# Altium project ESC30A.PrjPcb (part 1 of 2)
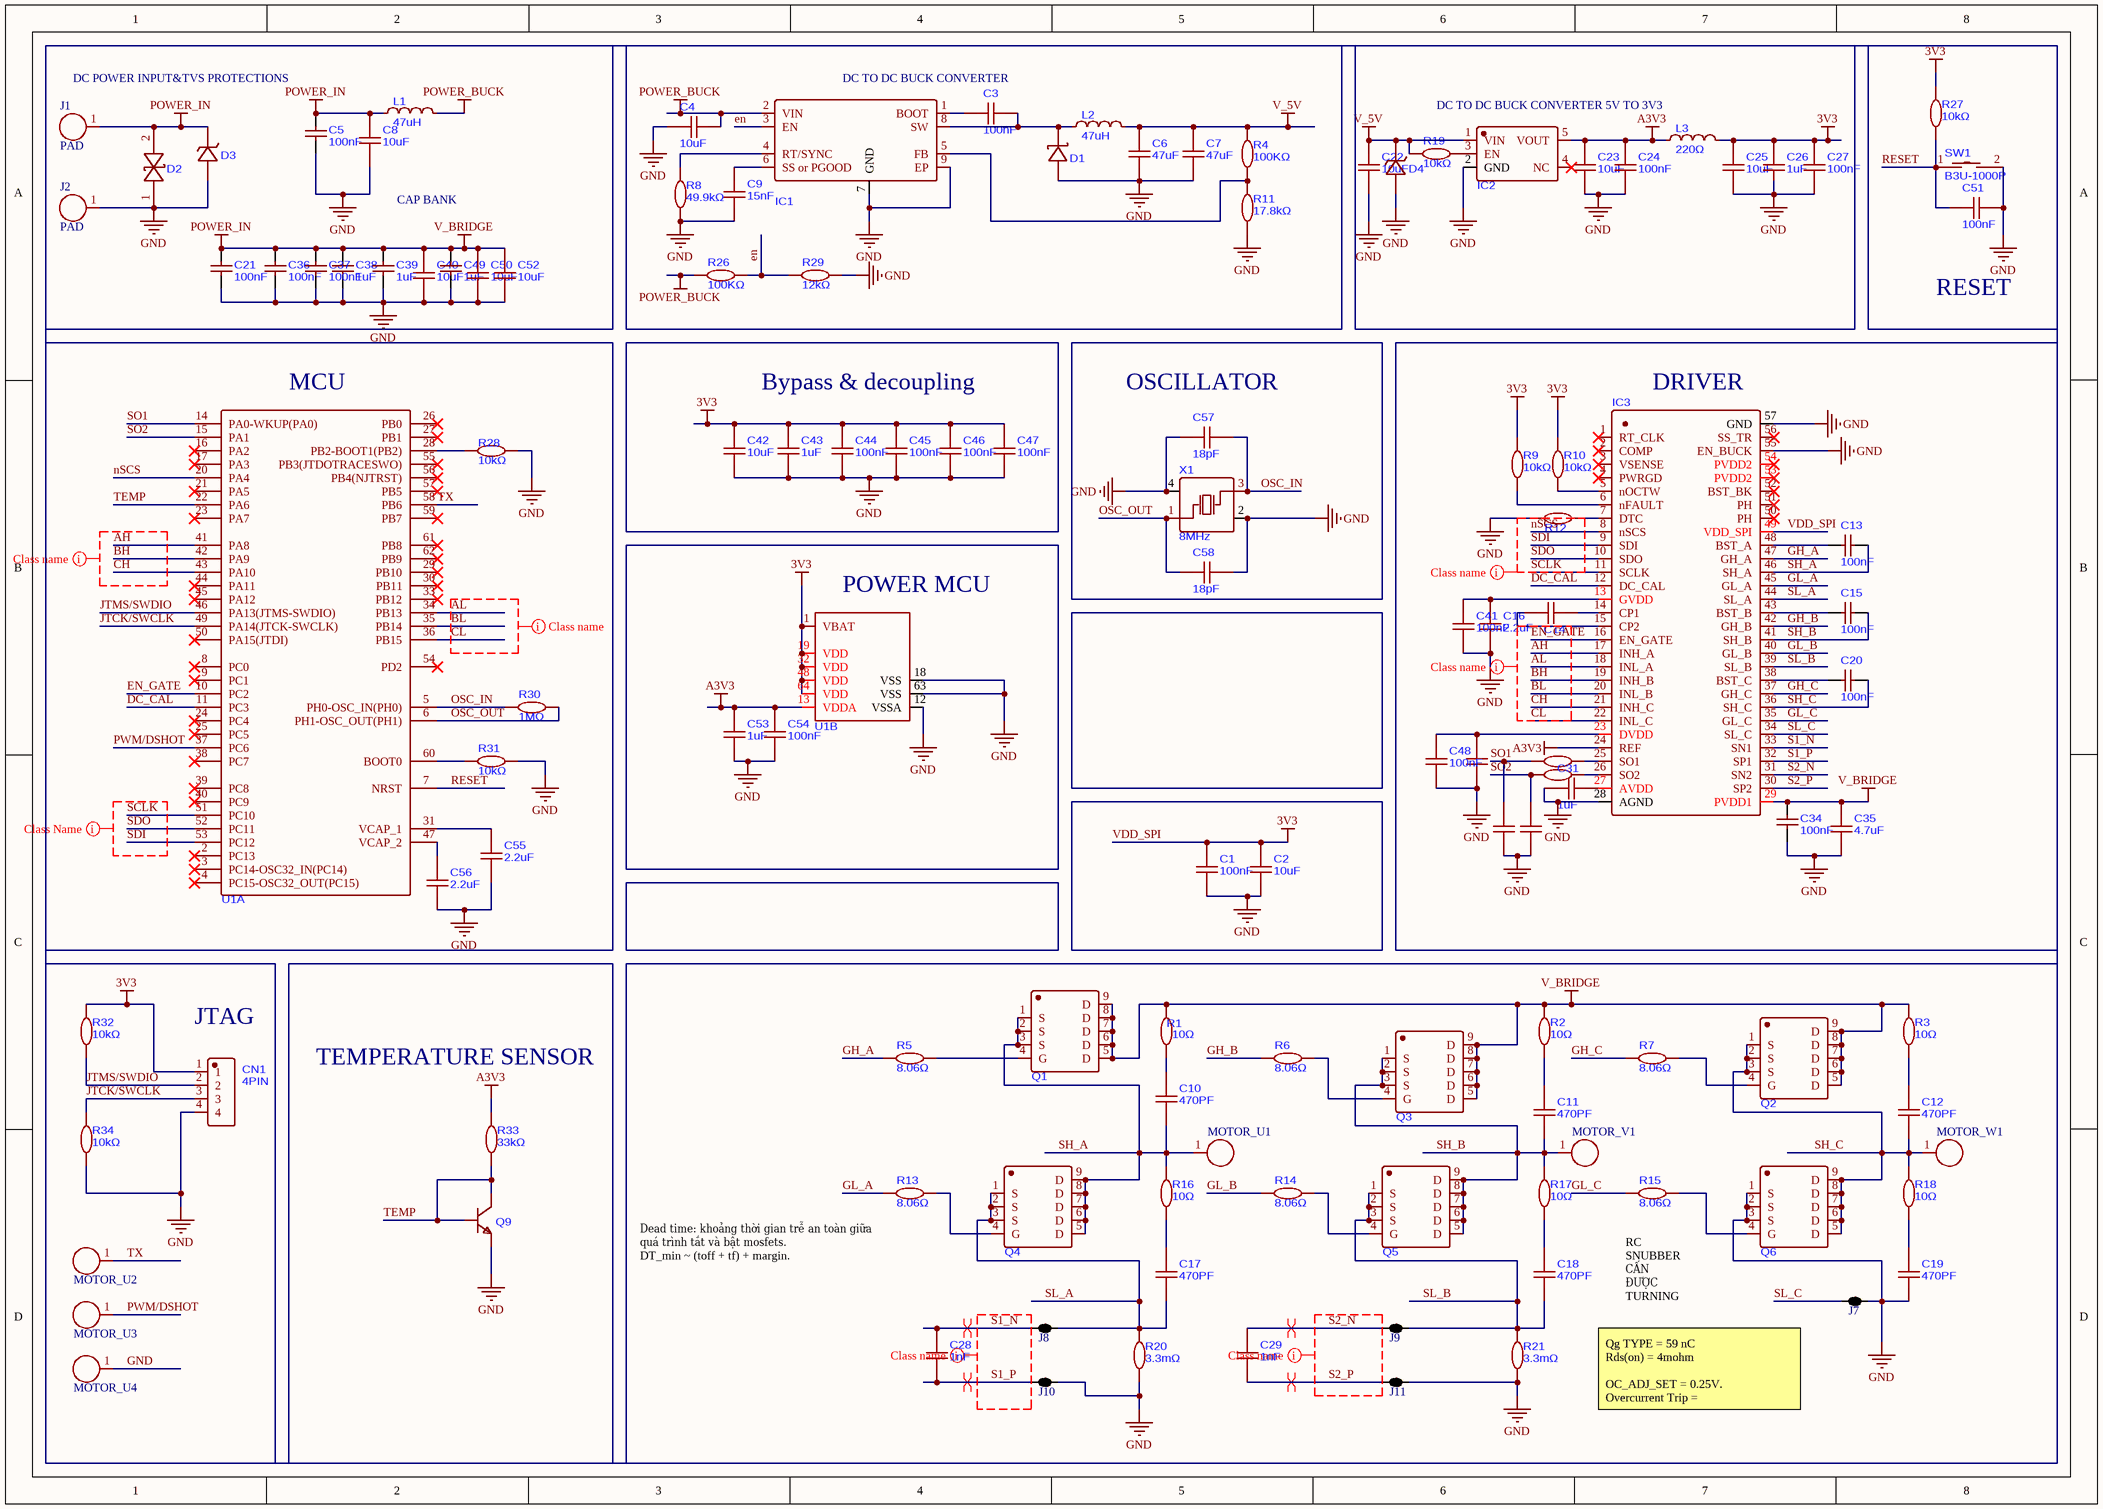
[diagram p0: ESC.SchDoc]
1 sheet, 124 parts. Net scope: global (net labels, ports and power ports of the same name join across sheets).
Board file: ESC.PcbDoc

## Sheet ESC.SchDoc
size A3; SheetNumber: 1; SheetTotal: 1; SPICEModelCacheXTDNQIYX: <root> / <DocumentId>XTDNQIYX</DocumentId> / <CacheFrame Number="0"> / <Model Name="smcj54a" Kind="CKT"> / <Text>*produced by Vishay General Semiconductor Taiwan / *Allen Su, 2015/12/24 / *   PSPICE / *                    anode     cathode / * Reverse direction: node 9 &lt;- node 2 / .SUBCKT smcj54a 9 2 / DF 9 90 DFMOD / .MODEL DFMOD D N = 2 IS = 1E-009 RS = 0.0184853 / + EG = 1.11 XTI = 3 / + CJO = 1.606E-009 VJ = 1.68538 M = 0.42 FC = 0.5 / + TT = 1E-008 T_MEASURED = 25 / * Leakage / RL 9 90 RLMOD 5.4E+007 / .MODEL RLMOD RES TC1 = 0 TC2 = 0 T_MEASURED = 25 / * Breakdown / RBD 90 4 1.392 / EBD 4 3 10 20 1 / DBD 3 9 DBDMOD / .MODEL DBDMOD D IS = 1E-015 N = 0.5 T_MEASURED = 25 T_ABS = 25 / IBVC 0 10 0.001 / RBVC 10 0 RBVCMOD 63150 / .MODEL RBVCMOD RES TC1 = 0 T_MEASURED = 25 / RBDX 20 23 1.392 / DBVC 23 0 DBDMOD / IBVD 0 20 0.001 / L1 90 2 1E-015 / .ENDS</Text> / </Model> / <Model Name="d_d1" Kind="MDL"> / <Text>*$ / .MODEL D_D1 D( IS=1e-15 TT=10p Rs=0.05 N=.1  VJ=10m)</Text> / </Model> / <Model Name="buf_delay_basic_gen" Kind="CKT"> / <Text>*$ / .SUBCKT BUF_DELAY_BASIC_GEN A  Y PARAMS: VDD=1 VSS=0 VTHRESH=0.5 DELAY = 10n / E_ABMGATE1    YINT1 0 VALUE {{IF(V(A) &gt; {VTHRESH} , / + {VDD},{VSS})}} / RINT YINT1 YINT2 1 / CINT YINT2 0 {DELAY*1.3} / E_ABMGATE2    YINT3 0 VALUE {{IF(V(YINT2) &gt; {VTHRESH} , / + {VDD},{VSS})}} / RINT2 YINT3 Y 1 / CINT2 Y 0 1n / .ENDS BUF_DELAY_BASIC_GEN</Text> / </Model> / <Model Name="and2_basic_gen" Kind="CKT"> / <Text>*$ / .SUBCKT AND2_BASIC_GEN A B Y PARAMS: VDD=1 VSS=0 VTHRESH=0.5 / E_ABMGATE    YINT 0 VALUE {{IF(V(A) &gt; {VTHRESH}  &amp; / + V(B) &gt; {VTHRESH},{VDD},{VSS})}} / RINT YINT Y 1 / CINT Y 0 1n / .ENDS AND2_BASIC_GEN</Text> / </Model> / <Model Name="oscillator_rt_sync_u100_h13" Kind="CKT"> / <Text>*$ / .subckt Oscillator_RT_SYNC_U100_H13 1 2 3 4 / H_U100_H13         3 4 VH_U100_H13 -1 / VH_U100_H13         1 2 0V / .ends Oscillator_RT_SYNC_U100_H13</Text> / </Model> / <Model Name="or2_basic_gen" Kind="CKT"> / <Text>*$ / .SUBCKT OR2_BASIC_GEN A B Y PARAMS: VDD=1 VSS=0 VTHRESH=0.5 / E_ABMGATE    YINT 0 VALUE {{IF(V(A) &gt; {VTHRESH}  | / + V(B) &gt; {VTHRESH},{VDD},{VSS})}} / RINT YINT Y 1 / CINT Y 0 1n / .ENDS OR2_BASIC_GEN</Text> / </Model> / <Model Name="inv_basic_gen" Kind="CKT"> / <Text>*$ / .SUBCKT INV_BASIC_GEN A  Y PARAMS: VDD=1 VSS=0 VTHRESH=0.5 / E_ABMGATE    YINT 0 VALUE {{IF(V(A) &gt; {VTHRESH} , / + {VSS},{VDD})}} / RINT YINT Y 1 / CINT Y 0 1n / .ENDS INV_BASIC_GEN</Text> / </Model> / <Model Name="oscillator_rt_sync_u100_s60" Kind="CKT"> / <Text>*$ / .subckt Oscillator_RT_SYNC_U100_S60 1 2 3 4 / S_U100_S60         3 4 1 2 _U100_S60 / RS_U100_S60         1 2 1G / .MODEL         _U100_S60 VSWITCH Roff=100e6 Ron=1u Voff=0.2 Von=0.8 / .ends Oscillator_RT_SYNC_U100_S60</Text> / </Model> / <Model Name="comp_basic_gen" Kind="CKT"> / <Text>*$ / .SUBCKT COMP_BASIC_GEN INP INM Y PARAMS: VDD=1 VSS=0 VTHRESH=0.5 / E_ABM Yint 0 VALUE {IF (V(INP) &gt; / + V(INM), {VDD},{VSS})} / R1 Yint Y 1 / C1 Y 0 1n / .ENDS COMP_BASIC_GEN</Text> / </Model> / <Model Name="d_d2" Kind="MDL"> / <Text>*$ / .MODEL D_D2 D( IS=1e-15 TT=10p Rs=0.05 N=1m  VJ=10m)</Text> / </Model> / <Model Name="comphys_basic_gen" Kind="CKT"> / <Text>*$ / .SUBCKT COMPHYS_BASIC_GEN INP INM HYS OUT PARAMS: VDD=1 VSS=0 VTHRESH=0.5 / EIN INP1 INM1 INP INM 1 / EHYS INP1 INP2 VALUE { IF( V(1) &gt; {VTHRESH},-V(HYS),0) } / EOUT OUT 0 VALUE { IF( V(INP2)&gt;V(INM1), {VDD} ,{VSS}) } / R1 OUT 1 1 / C1 1 0 1n / RINP1 INP1 0 1K / .ENDS COMPHYS_BASIC_GEN</Text> / </Model> / <Model Name="and4_basic_gen" Kind="CKT"> / <Text>*$ / .SUBCKT AND4_BASIC_GEN A B C D Y PARAMS: VDD=1 VSS=0 VTHRESH=0.5 / E_ABMGATE    YINT 0 VALUE {{IF(V(A) &gt; {VTHRESH}  &amp; / + V(B) &gt; {VTHRESH} &amp; / + V(C) &gt; {VTHRESH} &amp; / + V(D) &gt; {VTHRESH},{VDD},{VSS})}} / RINT YINT Y 1 / CINT Y 0 1n / .ENDS AND4_BASIC_GEN</Text> / </Model> / <Model Name="oscillator_rt_sync_u100_s59" Kind="CKT"> / <Text>*$ / .subckt Oscillator_RT_SYNC_U100_S59 1 2 3 4 / S_U100_S59         3 4 1 2 _U100_S59 / RS_U100_S59         1 2 1G / .MODEL         _U100_S59 VSWITCH Roff=100e6 Ron=1m Voff=0.4 Von=0.5 / .ends Oscillator_RT_SYNC_U100_S59</Text> / </Model> / <Model Name="driver_u8_s35" Kind="CKT"> / <Text>*$ / .subckt Driver_U8_S35 1 2 3 4 / S_U8_S35         3 4 1 2 _U8_S35 / RS_U8_S35         1 2 1G / .MODEL         _U8_S35 VSWITCH Roff=1000e6 Ron=15 Voff=0.2 Von=0.8 / .ends Driver_U8_S35</Text> / </Model> / <Model Name="driver_u8_s31" Kind="CKT"> / <Text>*$ / .subckt Driver_U8_S31 1 2 3 4 / S_U8_S31         3 4 1 2 _U8_S31 / RS_U8_S31         1 2 1G / .MODEL         _U8_S31 VSWITCH Roff=1000e6 Ron=155m Voff=1.0 Von=1.2 / .ends Driver_U8_S31</Text> / </Model> / <Model Name="driver_u8_s37" Kind="CKT"> / <Text>*$ / .subckt Driver_U8_S37 1 2 3 4 / S_U8_S37         3 4 1 2 _U8_S37 / RS_U8_S37         1 2 1G / .MODEL         _U8_S37 VSWITCH Roff=1e9 Ron=1m Voff=0.2V Von=0.8V / .ends Driver_U8_S37</Text> / </Model> / <Model Name="driver_u8_s5" Kind="CKT"> / <Text>*$ / .subckt Driver_U8_S5 1 2 3 4 / S_U8_S5         3 4 1 2 _U8_S5 / RS_U8_S5         1 2 1G / .MODEL         _U8_S5 VSWITCH Roff=1e9 Ron=2 Voff=0.2 Von=0.8 / .ends Driver_U8_S5</Text> / </Model> / <Model Name="d_d3" Kind="MDL"> / <Text>*$ / .MODEL D_D3 D( IS=1e-15 TT=10p Rs=0.01 N=1m  VJ=10m)</Text> / </Model> / <Model Name="driver_u8_h2" Kind="CKT"> / <Text>*$ / .subckt Driver_U8_H2 1 2 3 4 / H_U8_H2         3 4 VH_U8_H2 1 / VH_U8_H2         1 2 0V / .ends Driver_U8_H2</Text> / </Model> / <Model Name="driver_u8_s4" Kind="CKT"> / <Text>*$ / .subckt Driver_U8_S4 1 2 3 4 / S_U8_S4         3 4 1 2 _U8_S4 / RS_U8_S4         1 2 1G / .MODEL         _U8_S4 VSWITCH Roff=1e9 Ron=1.0 Voff=0.2 Von=0.8 / .ends Driver_U8_S4</Text> / </Model> / <Model Name="d_d" Kind="CKT"> / <Text>*$ / .subckt d_d 1 2 / d1 1 2 dd1 / .model dd1 d / + is=1e-015 / + tt=1e-011 / + rs=0.05 / + n=0.1 / .ends d_d</Text> / </Model> / <Model Name="or3_basic_gen" Kind="CKT"> / <Text>*$ / .SUBCKT OR3_BASIC_GEN A B C Y PARAMS: VDD=1 VSS=0 VTHRESH=0.5 / E_ABMGATE    YINT 0 VALUE {{IF(V(A) &gt; {VTHRESH}  | / + V(B) &gt; {VTHRESH} | / + V(C) &gt; {VTHRESH},{VDD},{VSS})}} / RINT YINT Y 1 / CINT Y 0 1n / .ENDS OR3_BASIC_GEN</Text> / </Model> / <Model Name="inv_delay_basic_gen" Kind="CKT"> / <Text>*$ / .SUBCKT INV_DELAY_BASIC_GEN A  Y PARAMS: VDD=1 VSS=0 VTHRESH=0.5 DELAY = 10n / E_ABMGATE1    YINT1 0 VALUE {{IF(V(A) &gt; {VTHRESH} , / + {VDD},{VSS})}} / RINT YINT1 YINT2 1 / CINT YINT2 0 {DELAY*1.3} / E_ABMGATE2    YINT3 0 VALUE {{IF(V(YINT2) &gt; {VTHRESH} , / + {VSS},{VDD})}} / RINT2 YINT3 Y 1 / CINT2 Y 0 1n / .ENDS INV_DELAY_BASIC_GEN</Text> / </Model> / <Model Name="ss2gm" Kind="CKT"> / <Text>*$ / .SUBCKT ss2gm SS GM / EPOLY GM 0 TABLE {V(SS)} = (0.5,10.9u) (0.55,12.4u) (0.6,17.5u) (0.65,23.7u) (0.7,27.1u) / + (0.75,28.5u)(.8,29.1u)(.85,29.3u) (.9,29.4u) (.95,29.6u) (1,30u) / .ENDS ss2gm</Text> / </Model> / <Model Name="erroramp_u5_s5" Kind="CKT"> / <Text>*$ / .subckt ErrorAmp_U5_S5 1 2 3 4 / S_U5_S5         3 4 1 2 _U5_S5 / RS_U5_S5         1 2 1G / .MODEL         _U5_S5 VSWITCH Roff=1e10 Ron=1m Voff=0.1 Von=0.9 / .ends ErrorAmp_U5_S5</Text> / </Model> / <Model Name="and3_basic_gen" Kind="CKT"> / <Text>*$ / .SUBCKT AND3_BASIC_GEN A B C Y PARAMS: VDD=1 VSS=0 VTHRESH=0.5 / E_ABMGATE    YINT 0 VALUE {{IF(V(A) &gt; {VTHRESH}  &amp; / + V(B) &gt; {VTHRESH} &amp; / + V(C) &gt; {VTHRESH},{VDD},{VSS})}} / RINT YINT Y 1 / CINT Y 0 1n / .ENDS AND3_BASIC_GEN</Text> / </Model> / <Model Name="buf_basic_gen" Kind="CKT"> / <Text>*$ / .SUBCKT BUF_BASIC_GEN A  Y PARAMS: VDD=1 VSS=0 VTHRESH=0.5 / E_ABMGATE    YINT 0 VALUE {{IF(V(A) &gt; {VTHRESH} , / + {VDD},{VSS})}} / RINT YINT Y 1 / CINT Y 0 1n / .ENDS BUF_BASIC_GEN</Text> / </Model> / <Model Name="srlatchrhp_basic_gen" Kind="CKT"> / <Text>*$ / .SUBCKT SRLATCHRHP_BASIC_GEN S R Q QB PARAMS: VDD=1 VSS=0 VTHRESH=0.5 / GQ 0 Qint VALUE = {IF(V(R) &gt; {VTHRESH},-5,IF(V(S)&gt;{VTHRESH},5, 0))} / CQint Qint 0 1n / RQint Qint 0 1000MEG / D_D10 Qint MY5 D_D1 / V1 MY5 0 {VDD} / D_D11 MYVSS Qint D_D1 / V2 MYVSS 0 {VSS} / EQ Qqq 0 Qint 0 1 / X3 Qqq Qqqd1 BUF_BASIC_GEN PARAMS: VDD={VDD} VSS={VSS} VTHRESH={VTHRESH} / RQq Qqqd1 Q 1 / EQb Qbr 0 VALUE = {IF( V(Q) &gt; {VTHRESH}, {VSS},{VDD})} / RQb Qbr QB 1 / Cdummy1 Q 0 1n / Cdummy2 QB 0 1n / .IC V(Qint) {VSS} / .ENDS SRLATCHRHP_BASIC_GEN</Text> / <Dependency>0\d_d1</Dependency> / <Dependency>0\buf_basic_gen</Dependency> / </Model> / <Model Name="lmr16030s_trans" Kind="CKT"> / <Text>*$ / * LMR16030 / ***************************************************************************** / * (C) Copyright 2016 Texas Instruments Incorporated. All rights reserved. / ***************************************************************************** / ** This model is designed as an aid for customers of Texas Instruments. / ** TI and its licensors and suppliers make no warranties, either expressed / ** or implied, with respect to this model, including the warranties of / ** merchantability or fitness for a particular purpose.  The model is / ** provided solely on an "as is" basis.  The entire risk as to its quality / ** and performance is with the customer / ***************************************************************************** / * / * This model is subject to change without notice. Texas Instruments / * Incorporated is not responsible for updating this model. / * / ***************************************************************************** / * / ** Released by: WEBENCH Design Center, Texas Instruments Inc. / * Part: LMR16030S / * Date: 06JUN2016 / * Model Type:  TRANSIENT / * Simulator: PSPICE / * Simulator Version: 16.2.0.p001 / * EVM Order Number: LMR16030PEVM / * EVM Users Guide: NA / * Datasheet: SNVSAH9A â€“DECEMBER 2015â€“REVISED MAY 2016 / * / * Model Version: Final 1.00 / * / ***************************************************************************** / * / * Updates: / * / * Final 1.00 / * Release to Web. / * / ***************************************************************************** / * / * Model Usage Notes: / * / * 1. All the features mentioned in the datasheet have been modelled except / *      a. Thermal behaviour / *      b. Operating quiescent current / *      c. Shutdown supply current / *      d. PLL lock in time / *      e. Sync feature works with fixed frequency external clock. If the clock frequency / *		  varies, switching frequency locks with minimum frequency of external clock. / * / ***************************************************************************** / .SUBCKT LMR16030S_TRANS BOOT EN FB GND RT/SYNC SS SW VIN PAD PARAMS: SS=0 / R_U100_R339         GND RT/SYNC  500meg / V_U100_V105         U100_N17467204 0 4.2Vdc / E_U100_ABM54         U100_N17466738 0 VALUE { / + {IF(V(U100_N17466711)&lt;0.1875,0.125*V(U100_N17466470), / + (IF(V(U100_N17466711)&lt;0.375,0.25*V(U100_N17466470), / + (IF(V(U100_N17466711)&lt;0.5625,0.5*V(U100_N17466470),V(U100_N17466470))))))} / +  } / D_U100_D78         U100_N17475790 U100_N17476944 D_D1 / E_U100_ABM51         U100_N17465902 0 VALUE { / +  if(V(U100_SYNC_DET)&gt;0.5,0,(((-V(I_RT)*1000) / + **(1/1.088))*90.52748*1u*1.015))   } / V_U100_V106         U100_N17503167 0 1 / X_U100_U725         U100_N17466245 U100_N17467423 U100_N17465899 AND2_BASIC_GEN / +  PARAMS: VDD=1 VSS=0 VTHRESH=500E-3 / X_U100_U183         SDWN U100_N17466875 U100_N17466883 OR2_BASIC_GEN PARAMS: / +  VDD=1 VSS=0 VTHRESH=500E-3 / E_U100_E56         U100_N17466711 0 FB GND 1 / X_U100_S60    U100_RAMP_CNTRL 0 U100_VRAMP 0 Oscillator_RT_SYNC_U100_S60 / X_U100_U600         RAMPIN U100_N17503167 MUXCLK COMP_BASIC_GEN PARAMS: VDD=1 / +  VSS=0 VTHRESH=0.5 / E_U100_E58         U100_N17466245 0 U100_N17475790 0 1 / X_U100_U730         U100_N17466245 U100_N17467414 INV_BASIC_GEN PARAMS: VDD=1 / +  VSS=0 VTHRESH=500E-3 / C_U100_C113         RAMPIN 0  5p IC=0 / G_U100_ABMII15         U100_N17466947 RAMPIN VALUE { V(U100_N17466738)    } / E_U100_ABM52         U100_N17465891 0 VALUE { IF(V(U100_SYNC_DET)&gt;.5,0,1)    } / X_U100_U186         U100_CLK_DET SDWN U100_RAMP_CNTRL OR2_BASIC_GEN PARAMS: / +  VDD=1 VSS=0 VTHRESH=500E-3 / V_U100_V104         U100_N17466947 0 5 / E_U100_ABM59         U100_SYNC_DET 0 VALUE { IF((V(U100_RT_SYNC_CHCK)&lt;0.98 &amp; / +  V(U100_RT_SYNC_CHCK)&gt;1.02),1,0)    } / E_U100_E53         U100_N17466093 0 U100_VRAMP U100_SYNC_FREQ_CHCK 1000000 / I_U100_I17         U100_N17467204 U100_VRAMP DC 1Adc / R_U100_R343         0 RT/SYNC  500MEG / V_U100_V103         U100_N17466912 U100_N17467201 0 / E_U100_ABM55         U100_N17476944 0 VALUE { IF(V(U100_SYNC_LVL_CHCK)&lt;0.5,0,1) / +     } / C_U100_C179         0 U100_VRAMP  1u IC=0 / E_U100_ABM53         U100_SYNC_FREQ_OK 0 VALUE { / +  IF((V(U100_SYNC_FREQ_CHCK)&gt;424.78m &amp; V(U100_SYNC_FREQ_CHCK)&lt;3.99),1,0)    } / C_U100_C112         0 U100_SYNC_FREQ_CHCK  1n  TC=0,0 / R_U100_R344         I_RT 0  1 / X_U100_U734         U100_N17467414 U100_N17467423 BUF_DELAY_BASIC_GEN PARAMS: / +  VDD=1 VSS=0 VTHRESH=0.5 DELAY=10n / D_U100_D73         U100_VRAMP U100_N17467204 D_D1 / C_U100_C177         0 U100_SYNC_EN  1n IC=0 TC=0,0 / X_U100_H13    RT/SYNC U100_N17466912 I_RT 0 Oscillator_RT_SYNC_U100_H13 / R_U100_R341         U100_SYNC_FREQ_OK U100_SYNC_EN  1 TC=0,0 / C_U100_C183         0 U100_N17475790  1n  TC=0,0 / D_U100_D77         U100_N17466093 U100_SYNC_FREQ_CHCK D_D2 / E_U100_E57         U100_N17466532 GND U100_N17465891 0 1 / E_U100_E55         U100_RT_SYNC_CHCK 0 RT/SYNC GND 1 / D_U100_D74         RAMPIN U100_N17466947 D_D1 / R_U100_R347         U100_N17476944 U100_N17475790  42 TC=0,0 / X_U100_U724         U100_RT_SYNC_CHCK U100_N17466179 U100_N17466150 / +  U100_SYNC_LVL_CHCK COMPHYS_BASIC_GEN PARAMS: VDD=1 VSS=0 VTHRESH=0.5 / E_U100_ABM56         U100_N17466470 0 VALUE { / +  IF(V(U100_SYNC_EN)&gt;0.5,V(U100_N17467666),V(U100_N17465902))    } / V_U100_V99         U100_N17466150 0 1.198 / E_U100_ABM57         U100_N17467666 0 VALUE { 5p/V(U100_FREQ_TO_TIME)    } / X_U100_U735         MUXCLK U100_N17466875 BUF_DELAY_BASIC_GEN PARAMS: VDD=1 / +  VSS=0 VTHRESH=0.5 DELAY=20n / R_U100_R340         U100_N17467201 U100_N17466532  1 / V_U100_V100         U100_N17466179 0 1.699 / X_U100_S59    U100_N17466883 0 RAMPIN 0 Oscillator_RT_SYNC_U100_S59 / E_U100_ABM58         U100_CLK_DET 0 VALUE { IF(V(U100_N17465899)&lt;0.5,0,1)    } / E_U100_ABM190         U100_FREQ_TO_TIME 0 VALUE { / +  V(U100_SYNC_FREQ_CHCK)*.000001    } / X_U8_S35    U8_BOOT_SW_ON 0 BOOT U8_N16795601 Driver_U8_S35 / D_U8_D14         SW U8_N16770032 D_D1 / X_U8_U616         U8_LDRV ENAB U8_BOOT_ON U8_SDWN_N U8_BOOT_SW_ON / +  AND4_BASIC_GEN PARAMS: VDD=1 VSS=0 VTHRESH=500E-3 / X_U8_U623         U8_N16769726 PWM_FINAL U8_HDRVIN AND2_BASIC_GEN PARAMS: VDD=1 / +  VSS=0 VTHRESH=500E-3 / R_U8_R250         U8_HDRVIN U8_N16829827  14.43 / E_U8_ABM3         U8_N168201641 0 VALUE { ((V(U8_OUT) *-100m)+ 3.3)    } / X_U8_U606         SDWN U8_SDWN_N INV_BASIC_GEN PARAMS: VDD=1 VSS=0 / +  VTHRESH=500E-3 / X_U8_S31    HDRV SW U8_N16770032 SW Driver_U8_S31 / C_U8_C144         0 U8_N16829827  1n / X_U8_U6         U8_N16820133 U8_N16820119 U8_OUT COMP_BASIC_GEN PARAMS: VDD=1 / +  VSS=0 VTHRESH=0.5 / X_U8_U617         U8_LDRV U8_N16771112 U8_N16825880 AND2_BASIC_GEN PARAMS: / +  VDD=1 VSS=0 VTHRESH=500E-3 / X_U8_U624         U8_HDRVIN U8_N16829827 U8_N16826034 AND2_BASIC_GEN PARAMS: / +  VDD=1 VSS=0 VTHRESH=500E-3 / R_U8_R4         U8_N168201641 U8_N16820119  1 / E_U8_ABM168         U8_N16820158 0 VALUE { {IF((V(BOOT) - V(SW)) &lt; 3.2,0,1)} / +  } / X_U8_U603         U8_OUT U8_BOOT_ON INV_BASIC_GEN PARAMS: VDD=1 VSS=0 / +  VTHRESH=500E-3 / X_U8_U625         SDWN U8_N16769726 INV_BASIC_GEN PARAMS: VDD=1 VSS=0 / +  VTHRESH=500E-3 / X_U8_S37    U8_BOOT_SW_ON 0 U8_N16797590 GND Driver_U8_S37 / R_U8_R247         U8_N16820158 BOOT_UVLO  1 / R_U8_R248         U8_N16826034 U8_N16826193  1 TC=0,0 / C_U8_C142         0 U8_N16826193  1.443n  TC=0,0 / C_U8_C4         0 U8_N16820119  1n / R_U8_R251         U8_LDRV U8_N16771112  14.43 / C_U8_C141         0 BOOT_UVLO  1n / X_U8_S5    U8_N16826193 0 BOOT HDRV Driver_U8_S5 / D_U8_D16         SW U8_N16797590 D_D3 / E_U8_ABM170         U8_N16820133 0 VALUE { V(BOOT) - V(SW)    } / C_U8_C145         0 U8_N16771112  1n / R_U8_R246         GND BOOT  10MEG / C_U8_C143         0 U8_N16771034  1.443n  TC=0,0 / D_U8_D15         VIN U8_N16795601 D_D1 / X_U8_H2    VIN U8_N16770032 ISW 0 Driver_U8_H2 / R_U8_R249         U8_N16825880 U8_N16771034  1 TC=0,0 / X_U8_S4    U8_N16771034 0 HDRV SW Driver_U8_S4 / X_U8_U621         U8_HDRVIN U8_LDRV INV_BASIC_GEN PARAMS: VDD=1 VSS=0 / +  VTHRESH=500E-3 / V_U11_V67         U11_N16734547 GND 1.2 / X_U11_U604         ENAB U11_N16734487 INV_BASIC_GEN PARAMS: VDD=1 VSS=0 / +  VTHRESH=500E-3 / X_U11_U605         U11_N16734651 UVLO INV_BASIC_GEN PARAMS: VDD=1 VSS=0 / +  VTHRESH=500E-3 / V_U11_V65         U11_N167343550 0 0.285 / I_U11_I1         0 EN DC 1u / X_U11_U615         VIN U11_N16734493 U11_N167343550 U11_N16734651 / +  COMPHYS_BASIC_GEN PARAMS: VDD=1 VSS=0 VTHRESH=0.5 / R_U11_R288         EN 0  10MEG / V_U11_V64         U11_N16734493 GND 4.2 / X_U11_U616         EN U11_N16734547 ENAB COMP_BASIC_GEN PARAMS: VDD=1 VSS=0 / +  VTHRESH=0.5 / X_U11_U601         U11_N16734487 UVLO SDWN OR2_BASIC_GEN PARAMS: VDD=1 VSS=0 / +  VTHRESH=500E-3 / G_U11_ABMII1         0 EN VALUE { if(V(ENAB)&gt;0.5,3.6u,0)    } / X_U7_U620         U7_N16489522 U7_N16489700 d_d PARAMS: / X_U7_U823         U7_N16497188 PWM_CLK U7_N16489522 AND2_BASIC_GEN PARAMS: / +  VDD=1 VSS=0 VTHRESH=500E-3 / X_U7_U824         U7_N16489522 U7_N16489700 PWM_CLK PWM_FINAL OR3_BASIC_GEN / +  PARAMS: VDD=1 VSS=0 VTHRESH=500E-3 / R_U7_R272         U7_N16489522 U7_N16489700  75 / X_U7_U822         PWM_CLK U7_N16497188 INV_DELAY_BASIC_GEN PARAMS: VDD=1 VSS=0 / +  VTHRESH=0.5 DELAY=15n / C_U7_C172         0 U7_N16489700  1.443n / R_U5_R12         U5_N16790193 COMP  360k / C_U5_C5         0 COMP  50f / R_U5_R4         0 COMP  250Meg / E_U5_E9         U5_N16790376 0 FB GND 1 / C_U5_C10         0 U5_N16790193  60p / E_U5_ABM8         U5_N16790300 0 VALUE { {IF(V(COMP) &gt; 2.2,1,0)}    } / X_U5_U615         SS_INT U5_N16790318 SS2GM / C_U5_C9         0 OL  1n / X_U5_U614         U5_N16790300 U5_N16790265 U5_N16790290 AND2_BASIC_GEN PARAMS: / +  VDD=1 VSS=0 VTHRESH=500E-3 / G_U5_ABM2I1         0 COMP VALUE { {LIMIT((V(VREF) - V(U5_N16790376))*V(U5_GM), / +  -3u,3u)}    } / X_U5_U603         SDWN U5_N16790265 INV_BASIC_GEN PARAMS: VDD=1 VSS=0 / +  VTHRESH=500E-3 / V_U5_V5         U5_N16790259 0 0.39 / R_U5_R11         U5_N16790290 OL  1 / C_U5_C166         0 U5_GM  1n / X_U5_S5    UVLO 0 COMP 0 ErrorAmp_U5_S5 / D_U5_D15         U5_N16790259 COMP D_D2 / R_U5_R290         U5_N16790318 U5_GM  1 / V_U5_V6         U5_N16790256 0 2.85 / D_U5_D16         COMP U5_N16790256 D_D2 / D_U4_D77         GND SS D_D2 / R_U4_R15         U4_N167408121 U4_N16740842  1 / G_U4_ABMII2         SS GND VALUE { {IF(V(U4_N16740842) &gt; 0.5,400u,0)}    } / E_U4_ABM178         VREF 0 VALUE { IF(V(SS_INT) &lt; 0.75, V(SS_INT),0.75)    } / C_U4_C15         0 U4_N16740842  1n / D_U4_D64         SS U4_N16740968 D_D1 / X_U4_U1         SDWN U4_N16741042 INV_BASIC_GEN PARAMS: VDD=1 VSS=0 / +  VTHRESH=500E-3 / V_U4_V71         U4_N16740968 GND 1.2Vdc / V_U4_V70         U4_N16741142 GND 2.85 / E_U4_E1         SS_INT 0 SS GND 1 / G_U4_ABMII1         U4_N16741142 SS VALUE { {IF(V(U4_N16741042) &gt; 0.5,3u,0)} / +  } / D_U4_D62         SS U4_N16741142 D_D1 / E_U4_ABM181         U4_N167408121 0 VALUE { {IF(V(SDWN) &gt; 0.5 | (V(OL) &gt; 0.5 ), / +  1,0)}    } / X_U6_U600         U6_ICTRL U6_ISWF U6_COM_PULSE COMP_BASIC_GEN PARAMS: VDD=1 / +  VSS=0 VTHRESH=0.5 / E_U6_ABM166         U6_N16795665 0 VALUE { {((V(COMP) /260k)  - 1.5u)*(17/6)} / +   } / E_U6_ABM151         U6_N16796154 0 VALUE { {IF(V(PWM_FINAL) &gt; 0.5, 1,0)}    } / D_U6_D58         U6_N16796158 U6_N16796154 D_D1 / E_U6_ABM149         U6_VRAMP 0 VALUE { V(RAMPIN)*0.0049897m    } / X_U6_U616         U6_N16796183 U6_N16799371 U6_N168023163 U6_OVTP / +  COMPHYS_BASIC_GEN PARAMS: VDD=1 VSS=0 VTHRESH=0.5 / E_U6_ABM152         U6_ISWF 0 VALUE { {IF(V(U6_N16796158) &gt; 0.5, / + V(ISW),0)}   } / E_U6_ABM168         U6_N16796216 0 VALUE { LIMIT(((V(U6_N16795665) - / +  V(U6_VRAMP)) * 10) / + ,6.369863u,99.749545u)   } / V_U6_V80         U6_N16795752 0 0.41 / E_U6_E9         U6_N16799371 0 FB GND 1 / V_U6_V79         U6_N16796183 0 .8025 / X_U6_U602         U6_COM_PULSE BOOT_UVLO U6_OVTP U6_N16795766 AND3_BASIC_GEN / +  PARAMS: VDD=1 VSS=0 VTHRESH=500E-3 / C_U6_C136         0 U6_ICTRL  1n / X_U6_U615         COMP U6_N16795752 U6_N16795706 U6_N16795759 COMPHYS_BASIC_GEN / +  PARAMS: VDD=1 VSS=0 VTHRESH=0.5 / R_U6_R240         U6_N16818592 U6_ICTRL  1 / X_U6_U625         U6_N16817255 U6_N16817360 INV_BASIC_GEN PARAMS: VDD=1 VSS=0 / +  VTHRESH=500E-3 / R_U6_R255         U6_N16796154 U6_N16796158  14.4k / X_U6_U605         U6_N16795766 U6_N16795759 U6_N16817255 AND2_BASIC_GEN PARAMS: / +  VDD=1 VSS=0 VTHRESH=500E-3 / V_U6_V81         U6_N16795706 0 0.01 / V_U6_V82         U6_N168023163 0 15m / E_U6_ABM208         U6_N16818592 0 VALUE { (V(U6_N16796216) * 47.096774k)    } / C_U6_C146         0 U6_N16796158  5p / X_U6_U15         MUXCLK U6_N16817360 PWM_CLK N16817937 SRLATCHRHP_BASIC_GEN / +  PARAMS: VDD=1 VSS=0 VTHRESH=0.5 / .IC         V(SS )={{SS}*2.85} / .ENDS LMR16030S_TRANS</Text> / <Dependency>0\d_d1</Dependency> / <Dependency>0\buf_delay_basic_gen</Dependency> / <Dependency>0\and2_basic_gen</Dependency> / <Dependency>0\oscillator_rt_sync_u100_h13</Dependency> / <Dependency>0\or2_basic_gen</Dependency> / <Dependency>0\inv_basic_gen</Dependency> / <Dependency>0\oscillator_rt_sync_u100_s60</Dependency> / <Dependency>0\comp_basic_gen</Dependency> / <Dependency>0\d_d2</Dependency> / <Dependency>0\comphys_basic_gen</Dependency> / <Dependency>0\and4_basic_gen</Dependency> / <Dependency>0\oscillator_rt_sync_u100_s59</Dependency> / <Dependency>0\driver_u8_s35</Dependency> / <Dependency>0\driver_u8_s31</Dependency> / <Dependency>0\driver_u8_s37</Dependency> / <Dependency>0\driver_u8_s5</Dependency> / <Dependency>0\d_d3</Dependency> / <Dependency>0\driver_u8_h2</Dependency> / <Dependency>0\driver_u8_s4</Dependency> / <Dependency>0\d_d</Dependency> / <Dependency>0\or3_basic_gen</Dependency> / <Dependency>0\inv_delay_basic_gen</Dependency> / <Dependency>0\ss2gm</Dependency> / <Dependency>0\erroramp_u5_s5</Dependency> / <Dependency>0\and3_basic_gen</Dependency> / <Dependency>0\srlatchrhp_basic_gen</Dependency> / </Model> / <Model Name="tph4r008qm_g0_00" Kind="CKT"> / <Text>* PSpice Unencrypted File / * / * This unencrypted file has been supplied by / * Toshiba Electronic Devices &amp; Storage Corporation / * that does not wish to publicize the technology / * used to implement this library. / * / * Permission is granted to use this file for / * simulations but not to reverse engineer its / * contents. / * When using Simulation Model, please be sure to / * visit "Simulation" page and re-confirm / * Restrictions on Usage, Limitations and others in / * "Cautions on Simulation Model" on Toshiba Electronic / * Devices &amp; Storage Corporation website. / * / ********************************************************************************* / * (C) Copyright 2021 Toshiba Electronic Devices &amp; Storage Corporation / * Date            : 23/03/2020 / * File Name       : TPH4R008QM_G0_00_PSpice_rev1.lib / * Part Number     : TPH4R008QM_G0_00 / * Parameter Rev.  : 1 / * Simulator       : PSpice (OrCAD 17.2) / * Model Call Name : TPH4R008QM_G0_00 / * TNOM            : 25 degree / * Pin Assign      : 1=Drain 2=Gate 3=Source / * / * Operation of this model has been verified only on the PSpice (OrCAD 17.2) / ********************************************************************************* / .SUBCKT TPH4R008QM_G0_00 1 2 3 / M0 1 22 3 3 smsmosfet / + L=1e-06 / + W=4 / + AD=4E-006 / + AS=4E-006 / + PD=8 / + PS=8 / D0 3 1 DDS1 / D1 3 1 DDS2 / D2 2 10 DGS1 / D3 3 10 DGS2 / R2 10 2 1E+009 / R3 10 3 1E+009 / RG 2 22 1.6 / .MODEL smsmosfet NMOS / + LEVEL=7 / + MOBMOD=1 / + CAPMOD=3 / + NOIMOD=1 / + TOX=2.5e-08 / + XJ=1.5E-007 / + NCH=1.7E+017 / + NGATE=0 / + RSH=0 / + TNOM=25 / + VTH0=3.725 / + VOFF=-0.18 / + NFACTOR=2.6 / + U0=2800 / + K1=0.5 / + K2=0 / + K3=80 / + K3B=0 / + W0=2.5E-006 / + NLX=1.74E-007 / + DVT0=2.2 / + DVT1=0.53 / + DVT2=-0.032 / + DVT0W=0 / + DVT1W=5.3E+006 / + DVT2W=-0.032 / + DWG=0 / + DWB=0 / + UA=9.0124e-09 / + UB=5.87E-019 / + UC=-4.65E-011 / + VSAT=27710.317 / + A0=6.1022 / + AGS=1.6111 / + B0=0 / + B1=0 / + KETA=-0.047 / + A1=0 / + A2=1 / + DELTA=0.066202 / + RDSW=9100 / + PRWG=0 / + PRWB=0 / + WR=1 / + CDSC=2.4E-004 / + CDSCD=0 / + CDSCB=0 / + CIT=0 / + ETA0=0.08 / + ETAB=-0.07 / + DSUB=0.56 / + PCLM=1e-05 / + PDIBLC1=0.10461 / + PDIBLC2=0.0028736 / + PDIBLCB=0 / + DROUT=0.56 / + PSCBE1=4.24E+008 / + PSCBE2=1E-009 / + PVAG=0 / + ALPHA0=0 / + ALPHA1=0 / + BETA0=30 / + NJ=1 / + JS=2e-07 / + XPART=0 / + CGSO=4.8e-10 / + CGDO=9e-12 / + CGBO=0 / + CGDL=9e-10 / + CGSL=2e-10 / + CKAPPA=0.185 / + CF=0 / + CLC=1E-007 / + CLE=0.6 / + VOFFCV=0 / + NOFF=1 / + DLC=0 / + ACDE=1 / + MOIN=15 / + CJ=0 / + CJSW=1E-012 / + CJSWG=1E-012 / + PB=1 / + PBSW=1 / + PBSWG=1 / + MJ=0.5 / + MJSW=0.33 / + MJSWG=0.33 / + AF=1 / + EF=1 / + KF=0 / + UTE=-1.4 / + KT1=-1.2 / + KT1L=0 / + KT2=0.022 / + UA1=4.31E-009 / + UB1=-7.61E-018 / + UC1=-5.6E-011 / + AT=3.3E+004 / + PRT=20000 / + XTI=3 / + TCJ=0 / + TPB=0 / + TCJSW=0 / + TPBSW=0 / + TCJSWG=0 / + TPBSWG=0 / + DWC=1.09 / .MODEL DDS1 D / + TNOM=25 / + IS=9.9997e-10 / + RS=0.0010306 / + N=1.3377 / + CJO=2e-09 / + VJ=0.9 / + M=0.33 / + XTI=0 / + TT=3.45e-08 / + BV=80 / + IBV=0.01 / .MODEL DDS2 D / + TNOM=25 / + IS=9.9997e-10 / + RS=0.0010306 / + N=1.3377 / + CJO=1E-15 / + VJ=0.7 / + M=0.3 / + XTI=0 / + TT=3.45e-08 / .MODEL DGS1 D / + TNOM=25 / + IS=1E-015 / .MODEL DGS2 D / + TNOM=25 / + IS=1E-015 / .ENDS</Text> / </Model> / <Model Name="spx3819" Kind="CKT"> / <Text>.SUBCKT SPX3819 VIN VOUT GND EN / * PARAMETERS / .PARAM VREF=3.3 / .PARAM VDROP=0.34 / .PARAM ILIM=0.9 / .PARAM ROUT=0.05 / * Enable logic (EN &gt; 1V) / EEN VEN 0 VALUE = { V(EN) &gt; 1 } / * Regulator core (with dropout) / EREG VREG 0 VALUE = { V(VEN)*LIMIT(V(VIN)-VDROP, 0, VREF) } / * Output resistance / Rout VREG VOUT {ROUT} / * Current sense / Rsense VOUT VSENSE 0.01 / * Current limit clamp / GCLAMP VOUT 0 VALUE = { / IF(I(Rsense) &gt; ILIM, -(I(Rsense)-ILIM)*5, 0) / } / * Ground reference / RGND GND 0 1m / .ENDS SPX3819</Text> / </Model> / <Model Name="fb_220_adv" Kind="CKT"> / <Text>.SUBCKT FB_220_ADV 1 2 / Rdc 1 2 0.045 / * low freq inductive / L1 1 3 50n / R1 3 2 1 / * high freq loss / R2 1 2 200 / Cpar 1 2 2p / .ends FB_220_ADV</Text> / </Model> / <Model Name="mmbt3904" Kind="CKT"> / <Text>* SPICE model NPN bipolar transistor ***MMBT3904*** / * Use the symbol file ***mmbt3904.asy*** / * / * (c) Diotec Semiconductor AG / * www.diotec.com / * 2024-10-15 / * / ********************************************************* / * This model is for simulation purposes only. It does   * / * not replace reviewing of the data sheet nor real life * / * testing of the part inside the application.           * / ********************************************************* / * / .subckt MMBT3904 C  B  E  params: Vceo=40 Vcbo=60 Vebo=6 Ic=200m hfe=300 Ices=100n Vbe=700m ft=300Meg Ccbo=4p Cebo=8p Rc=1 Rb=.1 Re=.1 Eg=1.11 Xti=3 / * Above values are an example for the ***MMBT3904***. Using the / * above symbol file allows for direct insertion of other values / * according to these data sheet parameters: / * / * Vceo    	Collector Emitter voltage, Base open / * Vcbo		Collector Base voltage, Emitter open / * Vebo    	Emitter Base voltage, Collector open / * Ic		DC Collector current / * hfe		Max DC current gain / * Ices		Collector Emitter cut-off current / * Vbe		Min Base Emitter voltage / * ft		Gain bandwidth product / * Ccbo		Typ. Collector Base capacitance / * Cebo		Typ. Emitter Base capacitance / * Rc/Rb/Re	Fixed values / * / * Activation energy: Eg=1.11 for Si (npn) transistor / * Sat.-current temp. exp: Xti=3 for Si (npn) transistor / Q  C B E  Transistor / .model Transistor NPN(Is={Ices/2} Bf={hfe} Bvcbo={Vcbo} Bvbe={-Vebo} Vceo={Vceo} Vje={Vbe} Tf={1/(2*pi*ft)} Eg={Eg} Xti={Xti} Icrating={Ic} Cjc={Ccbo*2} Cje={Cebo*2} Rc={Rc} Rb={Rb} Re={Re} mfg=Diotec) / .ends</Text> / </Model> / <Model Name="dallasamp_outputcir_iscvlimit_ht4" Kind="CKT"> / <Text>.SUBCKT DallasAmp_OutputCir_IscVlimit_HT4 A B VCC VEE PARAMS: / +RIsc 		 = { 100m } / +IscVsVsupply_X1 = { 3.0 } / +IscVsVsupply_Y1 = { 75m } / +IscVsVsupply_X2 = { 5.0 } / +IscVsVsupply_Y2 = { 100m } / .PARAM IscVsVsupply_SLOPE = / + { ( IscVsVsupply_Y2 - IscVsVsupply_Y1 ) / ( IscVsVsupply_X2 - IscVsVsupply_X1 ) } / .PARAM IscVsVsupply_INTCP = / + { IscVsVsupply_Y1 - IscVsVsupply_SLOPE * IscVsVsupply_X1 } / EIscVsVsupply IscVsVsupply 0 VALUE = / + { IscVsVsupply_SLOPE * V(VCC,VEE) + IscVsVsupply_INTCP  } / E1 A B VALUE = { V(IscVsVsupply) * RIsc } / .ENDS</Text> / </Model> / <Model Name="dallasamp_outputcir_isourcevlimit_ht4" Kind="CKT"> / <Text>.SUBCKT DallasAmp_OutputCir_IsourceVlimit_HT4 A B VCC VEE / X1 A B VCC VEE DallasAmp_OutputCir_IscVlimit_HT4 PARAMS: / +RIsc 		 = { 100m } / +IscVsVsupply_X1 = { 4.0 } / +IscVsVsupply_Y1 = { ABS(100m) } / +IscVsVsupply_X2 = { 6.0 } / +IscVsVsupply_Y2 = { ABS(100m) } / .ENDS</Text> / <Dependency>0\dallasamp_outputcir_iscvlimit_ht4</Dependency> / </Model> / <Model Name="outputcir_iscdiodeideal" Kind="CKT"> / <Text>.SUBCKT OutputCir_IscDiodeIdeal NEG POS PARAMS: / + IS = 1E-14 / + N  = 50m / G1 POS NEG_INT VALUE = { IF ( V(POS,NEG_INT) &lt;= 0, IS, IS * ( EXP ( V(POS,NEG_INT)/25m / + * 1/N)-0 ))} / V1 NEG_INT NEG {-N*0.8} / .ENDS</Text> / </Model> / <Model Name="dallasamp_outputcir_vohvol_ht4" Kind="CKT"> / <Text>.SUBCKT DallasAmp_OutputCir_VOHVOL_HT4 A B C  PARAMS: / + VSUPPLYREF    = {2.5} / + VOUTvsIOUT_X1 = { 0 } / + VOUTvsIOUT_Y1 = { 2.4 } / + VOUTvsIOUT_X2 = { 100m } / + VOUTvsIOUT_Y2 = { 2.1 } / .PARAM VDROPvsIOUT_X1 = { VOUTvsIOUT_X1 } / .PARAM VDROPvsIOUT_Y1 = { ABS(VSUPPLYREF-VOUTvsIOUT_Y1) } / .PARAM VDROPvsIOUT_X2 = { VOUTvsIOUT_X2 } / .PARAM VDROPvsIOUT_Y2 = { ABS(VSUPPLYREF-VOUTvsIOUT_Y2) } / .PARAM VDROPvsIOUT_SLOPE = / + { ( VDROPvsIOUT_Y2 - VDROPvsIOUT_Y1 ) / ( VDROPvsIOUT_X2 - VDROPvsIOUT_X1 ) } / .PARAM VDROPvsIOUT_INTCP = / + { VDROPvsIOUT_Y1 - VDROPvsIOUT_SLOPE * VDROPvsIOUT_X1 } / EVDROPvsIOUT VDROPvsIOUT 0 VALUE = / + { VDROPvsIOUT_SLOPE * V(C) + VDROPvsIOUT_INTCP  } / E1 A B VALUE = { V(VDROPvsIOUT) } / .ENDS</Text> / </Model> / <Model Name="dallasamp_outputcir_voh_ht4" Kind="CKT"> / <Text>.SUBCKT DallasAmp_OutputCir_VOH_HT4 A B C / X1 A B C DallasAmp_OutputCir_VOHVOL_HT4 PARAMS: / + VSUPPLYREF    = {6} / + VOUTvsIOUT_X1 = { ABS(0) } / + VOUTvsIOUT_Y1 = { 5.7 } / + VOUTvsIOUT_X2 = { ABS(100m) } / + VOUTvsIOUT_Y2 = { 5.7 } / .ENDS</Text> / <Dependency>0\dallasamp_outputcir_vohvol_ht4</Dependency> / </Model> / <Model Name="dallasamp_outputcir_isinkvlimit_ht4" Kind="CKT"> / <Text>.SUBCKT DallasAmp_OutputCir_IsinkVlimit_HT4 A B VCC VEE / X1 A B VCC VEE DallasAmp_OutputCir_IscVlimit_HT4 PARAMS: / +RIsc 		 = { 100m } / +IscVsVsupply_X1 = { 4.0 } / +IscVsVsupply_Y1 = { ABS(-100m) } / +IscVsVsupply_X2 = { 6.0 } / +IscVsVsupply_Y2 = { ABS(-100m) } / .ENDS</Text> / <Dependency>0\dallasamp_outputcir_iscvlimit_ht4</Dependency> / </Model> / <Model Name="dallasamp_outputcir_vol_ht4" Kind="CKT"> / <Text>.SUBCKT DallasAmp_OutputCir_VOL_HT4 A B C / X1 A B C DallasAmp_OutputCir_VOHVOL_HT4 PARAMS: / + VSUPPLYREF    = {0} / + VOUTvsIOUT_X1 = { ABS(0) } / + VOUTvsIOUT_Y1 = { 0.3 } / + VOUTvsIOUT_X2 = { ABS(-100m) } / + VOUTvsIOUT_Y2 = { 0.3 } / .ENDS</Text> / <Dependency>0\dallasamp_outputcir_vohvol_ht4</Dependency> / </Model> / <Model Name="dallasamp_outputcir_rout_ht4" Kind="CKT"> / <Text>.SUBCKT DallasAmp_OutputCir_Rout_HT4 B A VIMON / .PARAM Ro_Iout_0A = 100 / .PARAM RIsc = 100m / .PARAM Isc = 100m / .PARAM Islope = { 1/100 * Isc } / G1 A B VALUE = { V(A,B) * 1 / ( (Ro_Iout_0A - RIsc) * Islope / ( Islope + ABS(V(VIMON)) ) )   } / .ENDS</Text> / </Model> / <Model Name="dallasamp_diodeideal_ht4" Kind="CKT"> / <Text>.SUBCKT DallasAmp_DiodeIdeal_HT4 NEG POS / G1 POS NEG VALUE = { IF ( V(POS,NEG) &lt;= 0 , 0, V(POS,NEG)*0.01G ) } / R0 POS NEG 1000G / .ENDS</Text> / </Model> / <Model Name="dlsinv" Kind="CKT"> / <Text>.SUBCKT DLSINV 1 2 VDD_OLD VSS_OLD VDD_NEW VSS_NEW / E1 3 0 VALUE = { IF( V(1) &gt; (V(VDD_OLD)+V(VSS_OLD))/2, V(VSS_NEW), V(VDD_NEW) ) } / R1 3 2 1 / C1 2 0 1p / .ENDS</Text> / </Model> / <Model Name="dallasamp_outputcir_iload_ht4" Kind="CKT"> / <Text>.SUBCKT DallasAmp_OutputCir_ILOAD_HT4  VDD VSS VIMON PD / X1 PD PDINV VDD VSS LOGIC1 0 DLSINV / VLOGIC1 LOGIC1 0 1 / G1 VDD 0 VALUE = {IF(V(VIMON) &gt;= 0, V(VIMON)*( 1-V(PDINV) ), 0)} / G2 VSS 0 VALUE = {IF(V(VIMON)  &lt; 0, V(VIMON)*( 1-V(PDINV) ), 0)} / .ENDS</Text> / <Dependency>0\dlsinv</Dependency> / </Model> / <Model Name="analog_buffer" Kind="CKT"> / <Text>.subckt ANALOG_BUFFER VOUT VIN / R0 VIN 0 1e9 / R1 VOUT 0 1e9 / E0 VOUT 0 VIN 0 1 / .ends ANALOG_BUFFER</Text> / </Model> / <Model Name="dls" Kind="CKT"> / <Text>.SUBCKT DLS 1 2 VDD_OLD VSS_OLD VDD_NEW VSS_NEW / E1 3 0 VALUE = { IF( V(1) &lt; (V(VDD_OLD)+V(VSS_OLD))/2, V(VSS_NEW), V(VDD_NEW) ) } / R1 3 2 1 / C1 2 0 1p / .ENDS</Text> / </Model> / <Model Name="dallasamp_outputcir_recoveryassist_ht4" Kind="CKT"> / <Text>.SUBCKT DallasAmp_OutputCir_RecoveryAssist_HT4  VINP VINM IOUTP IOUTM VCC VEE RecoverySignal / X1 RecoverySignal RS VCC VEE LOGIC1 0 DLS / VLOGIC1 LOGIC1 0 1 / G1 IOUTP IOUTM VALUE = { LIMIT ( 1m * V(VINP,VINM) *  V(RS) , -100m, 100m ) } / .ENDS</Text> / <Dependency>0\dls</Dependency> / </Model> / <Model Name="hpa_or2" Kind="CKT"> / <Text>.SUBCKT HPA_OR2 1 2 3 VDD VSS / E1 4 0 VALUE = { IF( ((V(1)&lt; (V(VDD)+V(VSS))/2 ) &amp; (V(2)&lt; (V(VDD)+V(VSS))/2 )), V(VSS), V(VDD) ) } / R1 4 3 1 / C1 3 0 1e-12 / .ENDS</Text> / </Model> / <Model Name="hpa_comp_ideal" Kind="CKT"> / <Text>.SUBCKT HPA_COMP_IDEAL INP INN OUT VDD VSS / E1 OUT 0 VALUE = { IF( (V(INP) &gt; V(INN)), V(VDD), V(VSS) ) } / .ENDS</Text> / </Model> / <Model Name="dallasamp_outputcir_ht4" Kind="CKT"> / <Text>.subckt DALLASAMP_OUTPUTCIR_HT4 PD VCC VCCMAIN VEE VEEMAIN VIN VOUT / XI21 NET75 NET76 VCC VEE DallasAmp_OutputCir_IsourceVlimit_HT4 / XI20 NET79 NET092 VCC VEE DallasAmp_OutputCir_IsinkVlimit_HT4 / XI17 VOL VEE VIMONINV DallasAmp_OutputCir_VOL_HT4 / XI16 VCC VOH VIMON DallasAmp_OutputCir_VOH_HT4 / *DISOURCE NET092 NET75 OutputCir_Isc_DIDEAL / *DISINK NET76 NET79 OutputCir_Isc_DIDEAL / XI2500 NET75 NET092 OutputCir_IscDiodeIdeal PARAMS: IS=10e-15 N=50e-3 / XI2300 NET79 NET76 OutputCir_IscDiodeIdeal PARAMS: IS=10e-15 N=50e-3 / XI14 NET070 NET15 DallasAmp_DiodeIdeal_HT4 / XI15 NET068 VOL DallasAmp_DiodeIdeal_HT4 / XI0 VCCMAIN VEEMAIN VIMON PD DallasAmp_OutputCir_ILOAD_HT4 / XI1 NET53 NET22 VIMON DallasAmp_OutputCir_Rout_HT4 / XI6 NET22 NET0100 0 NET043 VCC VEE RECOVERYSIGNAL DallasAmp_OutputCir_RecoveryAssist_HT4 / XAHDLI43 NET055 NET054 RECOVERYSIGNAL VCC VEE HPA_OR2 / XAHDLI41 VOUT NET067 NET055 VCC VEE HPA_COMP_IDEAL / XAHDLI42 NET059 VOUT NET054 VCC VEE HPA_COMP_IDEAL / HVIMONINV VIMONINV 0 VCURSINKDETECT  1 / HVIMON VIMON 0 VCURSOURCEDETECT  1 / RVIMONINV VIMONINV 0 1e9 / RVIMON VIMON 0 1e9 / RISC NET092 NET15 100e-3 / ROUTMINOR NET0100 NET17 10 / XI11 NET76 NET15 ANALOG_BUFFER / XI2 NET22 VIN ANALOG_BUFFER / VPROBE3 NET070 VOH 0 / VPROBE2 NET043 NET0100 0 / VTRIGGERVOL NET059 VOL 10e-3 / VTRIGGERVOH VOH NET067 10e-3 / VPROBE4 NET068 NET15 0 / VCURSOURCEDETECT NET15 NET34 0 / VCURSINKDETECT VOUT NET34 0 / VPROBE1 NET53 NET17 0 / LOUT NET17 NET092 500e-12 / CP NET17 0 10e-15 / COUT NET22 NET0100 1e-15 / .ends DALLASAMP_OUTPUTCIR_HT4</Text> / <Dependency>0\dallasamp_outputcir_isourcevlimit_ht4</Dependency> / <Dependency>0\outputcir_iscdiodeideal</Dependency> / <Dependency>0\dallasamp_outputcir_voh_ht4</Dependency> / <Dependency>0\dallasamp_outputcir_isinkvlimit_ht4</Dependency> / <Dependency>0\dallasamp_outputcir_vol_ht4</Dependency> / <Dependency>0\dallasamp_outputcir_rout_ht4</Dependency> / <Dependency>0\dallasamp_diodeideal_ht4</Dependency> / <Dependency>0\dallasamp_outputcir_iload_ht4</Dependency> / <Dependency>0\analog_buffer</Dependency> / <Dependency>0\dallasamp_outputcir_recoveryassist_ht4</Dependency> / <Dependency>0\hpa_or2</Dependency> / <Dependency>0\hpa_comp_ideal</Dependency> / </Model> / <Model Name="dallasamp_nondompole_ht4" Kind="CKT"> / <Text>.subckt DALLASAMP_NONDOMPOLE_HT4 VIN VOUT / XI23 NET4 VIN ANALOG_BUFFER / C1 VOUT 0 1.035E-12 / R1 VOUT NET4 1 / .ends DALLASAMP_NONDOMPOLE_HT4</Text> / <Dependency>0\analog_buffer</Dependency> / </Model> / <Model Name="dallasamp_vinrange_ht4" Kind="CKT"> / <Text>.subckt DALLASAMP_VINRANGE_HT4 VCC VEE VIN VOUT / XIDVIH NET12 NET16 DallasAmp_DiodeIdeal_HT4 / XIDVIL NET16 NET20 DallasAmp_DiodeIdeal_HT4 / R0 VIN NET16 1e-3 / V0 NET16 VOUT 0 / VIL NET20 VEE -150e-03 / VIH VCC NET12 150e-03 / .ends DALLASAMP_VINRANGE_HT4</Text> / <Dependency>0\dallasamp_diodeideal_ht4</Dependency> / </Model> / <Model Name="dallasamp_dompole_ht4" Kind="CKT"> / <Text>.subckt DALLASAMP_DOMPOLE_HT4 A B / R0 B A 6.403E04 / C0 A B 9.26E-10 / .ends DALLASAMP_DOMPOLE_HT4</Text> / </Model> / <Model Name="dallasamp_recoverycircuit_ht4" Kind="CKT"> / <Text>.subckt DALLASAMP_RECOVERYCIRCUIT_HT4 A B VCC VEE / XI2 NET8 NET014 DallasAmp_DiodeIdeal_HT4 / XI3 NET014 NET9 DallasAmp_DiodeIdeal_HT4 / VBRIDGE NET014 A 0 / VPROBE A B 0 / VRECL NET9 VEE -10e-3 / VRECH VCC NET8 -10e-3 / .ends DALLASAMP_RECOVERYCIRCUIT_HT4</Text> / <Dependency>0\dallasamp_diodeideal_ht4</Dependency> / </Model> / <Model Name="dallasamp_iq_ht4" Kind="CKT"> / <Text>.subckt DallasAmp_Iq_HT4 VCCmain VEEmain PD VEE VCC / .PARAM IOFF = { 1n } / .PARAM ION_X1 = { 0.0 } / .PARAM ION_Y1 = { 1m } / .PARAM ION_X2 = { 1.6 } / .PARAM ION_Y2 = { 1m } / .PARAM ION_X3 = { 4.0 } / .PARAM ION_Y3 = { 1m } / .PARAM ION_X4 = { 6.0 } / .PARAM ION_Y4 = { 1m } / EION_SEG1 ION_SEG1 0 VALUE = { IF ( 		          V(VCC,VEE) &lt;= ION_X2, 1, 0 ) } / EION_SEG2 ION_SEG2 0 VALUE = { IF ( V(VCC,VEE) &gt; ION_X2 &amp; V(VCC,VEE) &lt;= ION_X3, 1, 0 ) } / EION_SEG3 ION_SEG3 0 VALUE = { IF ( V(VCC,VEE) &gt; ION_X3		              , 1, 0 ) } / .PARAM ION_SEG1_SLOPE = { ( ION_Y2 - ION_Y1 ) / ( ION_X2 - ION_X1 ) } / .PARAM ION_SEG1_INTCP = { ION_Y1 - ION_SEG1_SLOPE * ION_X1 } / .PARAM ION_SEG2_SLOPE = { ( ION_Y3 - ION_Y2 ) / ( ION_X3 - ION_X2 ) } / .PARAM ION_SEG2_INTCP = { ION_Y2 - ION_SEG2_SLOPE * ION_X2 } / .PARAM ION_SEG3_SLOPE = { ( ION_Y4 - ION_Y3 ) / ( ION_X4 - ION_X3 ) } / .PARAM ION_SEG3_INTCP = { ION_Y3 - ION_SEG3_SLOPE * ION_X3 } / EION ION 0 VALUE = { 	V(ION_SEG1) * ( ION_SEG1_SLOPE * V(VCC,VEE) + ION_SEG1_INTCP ) + / +			V(ION_SEG2) * ( ION_SEG2_SLOPE * V(VCC,VEE) + ION_SEG2_INTCP ) + / + 			V(ION_SEG3) * ( ION_SEG3_SLOPE * V(VCC,VEE) + ION_SEG3_INTCP ) 	} / X1 PD PDINV VCC VEE LOGIC1 0 DLSINV / VLOGIC1 LOGIC1 0 1 / G1 VCCMAIN VEEMAIN VALUE = { V(ION) * ( 1-V(PDINV) ) + IOFF * V(PDINV) } / .ends</Text> / <Dependency>0\dlsinv</Dependency> / </Model> / <Model Name="dallasamp_zin_ht4" Kind="CKT"> / <Text>.subckt DALLASAMP_ZIN_HT4 IN1 IN2 OUT1 OUT2 / R5 IN2 OUT2 100e-3 / R4 IN1 OUT1 100e-3 / C3 OUT1 OUT2 50e-15 / C2 OUT2 0 50e-15 / C1 OUT1 0 50e-15 / GR2 OUT2 0 OUT2 0 100e-12 / GR1 0 OUT1 0 OUT1 100e-12 / GR3 OUT1 OUT2 OUT1 OUT2 1e-9 / .ends DALLASAMP_ZIN_HT4</Text> / </Model> / <Model Name="dallasamp_gmitail_ht4" Kind="CKT"> / <Text>.SUBCKT DallasAmp_GmItail_HT4  Vinp Vinm Ioutp Ioutm VEE VCC PD / X1 PD PDINV VCC VEE LOGIC1 0 DLSINV / VLOGIC1 LOGIC1 0 1 / .PARAM ITAILMAX_X1 = { 3.0 } / .PARAM ITAILMAX_Y1 = { 10m } / .PARAM ITAILMAX_X2 = { 6.0 } / .PARAM ITAILMAX_Y2 = { 10m } / .PARAM ITAILMAX_SLOPE = / + { ( ITAILMAX_Y2 - ITAILMAX_Y1 ) / ( ITAILMAX_X2 - ITAILMAX_X1 ) } / .PARAM ITAILMAX_INTCP = / + { ITAILMAX_Y1 - ITAILMAX_SLOPE * ITAILMAX_X1 } / EITAILMAX ITAILMAX 0 VALUE = / + { ITAILMAX_SLOPE * V(VCC,VEE) + ITAILMAX_INTCP  } / .PARAM ITAILMIN_X1 = { 3.0 } / .PARAM ITAILMIN_Y1 = { 10m } / .PARAM ITAILMIN_X2 = { 6.0 } / .PARAM ITAILMIN_Y2 = { 10m } / .PARAM ITAILMIN_SLOPE = / + { ( ITAILMIN_Y2 - ITAILMIN_Y1 ) / ( ITAILMIN_X2 - ITAILMIN_X1 ) } / .PARAM ITAILMIN_INTCP = / + { ITAILMIN_Y1 - ITAILMIN_SLOPE * ITAILMIN_X1 } / EITAILMIN ITAILMIN 0 VALUE = / + { ITAILMIN_SLOPE * V(VCC,VEE) + ITAILMIN_INTCP  } / G1 IOUTP IOUTM VALUE = { LIMIT ( 1.562e-01 * V(VINP,VINM) * ( 1-V(PDINV) ) , -V(ITAILMIN), / + V(ITAILMAX) ) } / .ENDS</Text> / <Dependency>0\dlsinv</Dependency> / </Model> / <Model Name="hpa_inv_ideal" Kind="CKT"> / <Text>.SUBCKT HPA_INV_IDEAL 1 2 VDD VSS / E1 2 0 VALUE = { IF( V(1)&gt; (V(VDD)+V(VSS))/2, V(VSS), V(VDD) ) } / .ENDS</Text> / </Model> / <Model Name="cmrr_new" Kind="CKT"> / <Text>.SUBCKT CMRR_NEW   VI  VO VX GNDF PARAMS: CMRR = 130 FCMRR = 1.6K / .PARAM PI = 3.141592 / .PARAM RCMRR = 1 / .PARAM GCMRR = {PWR(10,-CMRR/20)/RCMRR} / .PARAM LCMRR = {RCMRR/(2*PI*FCMRR)} / G1  GNDF 1 VX GNDF {GCMRR} / R1  1 2 {RCMRR} / L1  2 GNDF {LCMRR} / EA  101 GNDF 1 GNDF 1 / GRA  101 102 VALUE = {V(101,102)/1e6} / CA  102 GNDF 1e3 / EB  1 1a VALUE = {V(102,GNDF)} / E1  VI VO 1a GNDF 1 / .ENDS</Text> / </Model> / <Model Name="dallasamp_cmrr_ht4" Kind="CKT"> / <Text>.SUBCKT DallasAmp_CMRR_HT4 A B C / .PARAM CMRR_DC 	             = -86 / .PARAM CMRR_f3dB             = 10e3 / .PARAM CMRR_f3dB_FudgeFactor = 1 / *.PARAM CMRR_f3dB_FudgeFactor = 3.4 / .PARAM CMRR       = {0-CMRR_DC} / .PARAM FCMRR	  = {CMRR_f3dB * CMRR_f3dB_FudgeFactor} / X1 A B C 0 CMRR_NEW PARAMS: CMRR = {CMRR} FCMRR = {FCMRR} / .ENDS</Text> / <Dependency>0\cmrr_new</Dependency> / </Model> / <Model Name="psrr_dual_new" Kind="CKT"> / <Text>.SUBCKT PSRR_DUAL_NEW   VDD  VSS  VI  VO  GNDF / + PARAMS: PSRRP = 130 FPSRRP = 1.6 / + PSRRN = 130 FPSRRN = 1.6 / .PARAM PI = 3.141592 / .PARAM RPSRRP = 1 / .PARAM GPSRRP = {PWR(10,-PSRRP/20)/RPSRRP} / .PARAM LPSRRP = {RPSRRP/(2*PI*FPSRRP)} / .PARAM RPSRRN = 1 / .PARAM GPSRRN = {PWR(10,-PSRRN/20)/RPSRRN} / .PARAM LPSRRN = {RPSRRN/(2*PI*FPSRRN)} / G1  GNDF 1 VDD GNDF {GPSRRP} / R1  1 2 {RPSRRP} / L1  2 GNDF {LPSRRP} / EA  101 GNDF 1 GNDF 1 / GRA  101 102 VALUE = { V(101,102)/1e6 } / CA  102 GNDF 1e3 / EB  1 1a VALUE = {V(102,GNDF)} / G2  GNDF 3 VSS GNDF {GPSRRN} / R2  3 4 {RPSRRN} / L2  4 GNDF {LPSRRN} / EC  301 GNDF 3 GNDF 1 / GRC  301 302 VALUE = { V(301,302)/1e6 } / CC  302 GNDF 1e3 / ED  3 3a VALUE = {V(302,GNDF)} / E1  VO VI VALUE = {V(1a,GNDF) + V(3a,GNDF)} / C3  VDD VSS 10P / .ENDS</Text> / </Model> / <Model Name="dallasamp_psrr_ht4" Kind="CKT"> / <Text>.SUBCKT DallasAmp_PSRR_HT4 VDD VSS A B / .PARAM PSRRP_DC    = -100 / .PARAM PSRRP_f3dB  = 100k / .PARAM PSRRN_DC    = -90 / .PARAM PSRRN_f3dB  = 90k / .PARAM PSRRP       = {0-PSRRP_DC} / .PARAM PSRRN       = {0-PSRRN_DC} / .PARAM FPSRRP      = {PSRRP_f3dB} / .PARAM FPSRRN      = {PSRRN_f3dB} / X1 VDD VSS A B 0 PSRR_DUAL_NEW PARAMS: / + PSRRP = {PSRRP} FPSRRP = {FPSRRP} / + PSRRN = {PSRRN} FPSRRN = {FPSRRN} / .ENDS</Text> / <Dependency>0\psrr_dual_new</Dependency> / </Model> / <Model Name="femt" Kind="CKT"> / <Text>.SUBCKT FEMT  1 2 PARAMS: NLFF = 0.1 FLWF = 0.001 NVRF = 0.1 / .PARAM GLFF={PWR(FLWF,0.25)*NLFF/1164} / .PARAM RNVF={1.184*PWR(NVRF,2)} / .MODEL DVNF D KF={PWR(FLWF,0.5)/1E11} IS=1.0E-16 / I1 0 7 10E-3 / I2 0 8 10E-3 / D1 7 0 DVNF / D2 8 0 DVNF / E1 3 6 7 8 {GLFF} / R1 3 0 1E9 / R2 3 0 1E9 / R3 3 6 1E9 / E2 6 4 5 0 10 / R4 5 0 {RNVF} / R5 5 0 {RNVF} / R6 3 4 1E9 / R7 4 0 1E9 / G1 1 2 3 4 1E-6 / C1 1 0 1E-15 / C2 2 0 1E-15 / C3 1 2 1E-15 / .ENDS</Text> / </Model> / <Model Name="dallasamp_inoise_ht4" Kind="CKT"> / <Text>.SUBCKT DallasAmp_Inoise_HT4 A B / .PARAM X = { 1m  } / .PARAM Y = { 100 } / .PARAM Z = { 1 } / X1 A B FEMT PARAMS: NLFF = { Y }  FLWF = { X } NVRF = { Z } / .ENDS</Text> / <Dependency>0\femt</Dependency> / </Model> / <Model Name="vnse" Kind="CKT"> / <Text>.SUBCKT VNSE  1 2 PARAMS: NLF = 10 FLW = 4  NVR = 4.6 / .PARAM GLF={PWR(FLW,0.25)*NLF/1164} / .PARAM RNV={1.184*PWR(NVR,2)} / .MODEL DVN D KF={PWR(FLW,0.5)/1E11} IS=1.0E-16 / I1 0 7 10E-3 / I2 0 8 10E-3 / D1 7 0 DVN / D2 8 0 DVN / E1 3 6 7 8 {GLF} / R1 3 0 1E9 / R2 3 0 1E9 / R3 3 6 1E9 / E2 6 4 5 0 10 / R4 5 0 {RNV} / R5 5 0 {RNV} / R6 3 4 1E9 / R7 4 0 1E9 / E3 1 2 3 4 1 / C1 1 0 1E-15 / C2 2 0 1E-15 / C3 1 2 1E-15 / .ENDS</Text> / </Model> / <Model Name="dallasamp_vnoise_ht4" Kind="CKT"> / <Text>.SUBCKT DallasAmp_Vnoise_HT4 A B / .PARAM X = { 1m  } / .PARAM Y = { 100 } / .PARAM Z = { 5  } / X1 A B VNSE PARAMS: NLF = { Y } FLW = { X }  NVR = { Z } / .ENDS</Text> / <Dependency>0\vnse</Dependency> / </Model> / <Model Name="vinoffset" Kind="CKT"> / <Text>.SUBCKT Vinoffset POS NEG PARAMS: / + TA     = 25 / + VOS    = 500u / + DRIFT  = 10u / E1 POS NEG VALUE = { DRIFT * TEMP + ( VOS - DRIFT * TA ) } / .ENDS</Text> / </Model> / <Model Name="dallasamp_ht4" Kind="CKT"> / <Text>.subckt DALLASAMP_HT4 VEE VCC VINM VINP VOUT PD / XI13 VEE_INT VEE ANALOG_BUFFER / XI12 VCC_INT VCC ANALOG_BUFFER / XI58 HIGHZ NET32 DALLASAMP_DOMPOLE_HT4 / XI28 NET41 NET51 VCC_INT VEE_INT DALLASAMP_RECOVERYCIRCUIT_HT4 / XI26 NET51 NET61 DALLASAMP_NONDOMPOLE_HT4 / XI30 POWER VCC_INT VCC VEE_INT VEE NET61 VOUT DALLASAMP_OUTPUTCIR_HT4 / IBIASP VINP_INT 0 100.5e-6 / IBIASM VINM_INT 0 99.5e-6 / XI56 VCC_INT VEE_INT NET22 VINM_INT DALLASAMP_VINRANGE_HT4 / XI54 VCC_INT VEE_INT NET21 VINP_INT DALLASAMP_VINRANGE_HT4 / XI53 VINP VINM NET1 NET2 DALLASAMP_ZIN_HT4 / XI40 VCC VEE POWER VEE_INT VCC_INT DallasAmp_Iq_HT4 / XI52 VINP_INT VINM_INT NET32 NET31 VEE_INT VCC_INT POWER DallasAmp_GmItail_HT4 / XAHDLINV3 PD PDINV VCC_INT VEE_INT HPA_INV_IDEAL / XAHDLINV1 PDINV POWER VCC_INT VEE_INT HPA_INV_IDEAL / XI21 NET12 NET22 NET12 DallasAmp_CMRR_HT4 / XI19 VCC_INT VEE_INT NET2 NET12 DallasAmp_PSRR_HT4 / XI18 NET11 NET2 DallasAmp_Inoise_HT4 / XI17 NET1 NET11 DallasAmp_Vnoise_HT4 / R14 VCC_INT PD 10e6 / *VINOFFSET NET21 NET11 4.00e-03 / XVINOFFSET NET21 NET11 Vinoffset PARAMS: TA=25 VOS=4.00e-03 DRIFT=10e-6 / VPROBE1 NET31 HIGHZ / VDOMPOLEBIAS NET32 0 0 / VPROBE2 HIGHZ NET41 / .ends DALLASAMP_HT4</Text> / <Dependency>0\dallasamp_outputcir_ht4</Dependency> / <Dependency>0\dallasamp_nondompole_ht4</Dependency> / <Dependency>0\analog_buffer</Dependency> / <Dependency>0\dallasamp_vinrange_ht4</Dependency> / <Dependency>0\dallasamp_dompole_ht4</Dependency> / <Dependency>0\dallasamp_recoverycircuit_ht4</Dependency> / <Dependency>0\dallasamp_iq_ht4</Dependency> / <Dependency>0\dallasamp_zin_ht4</Dependency> / <Dependency>0\dallasamp_gmitail_ht4</Dependency> / <Dependency>0\hpa_inv_ideal</Dependency> / <Dependency>0\dallasamp_cmrr_ht4</Dependency> / <Dependency>0\dallasamp_psrr_ht4</Dependency> / <Dependency>0\dallasamp_inoise_ht4</Dependency> / <Dependency>0\dallasamp_vnoise_ht4</Dependency> / <Dependency>0\vinoffset</Dependency> / </Model> / <Model Name="drv8301" Kind="CKT"> / <Text>.subckt DRV8301 AGND AVDD VINM VINP VOUT / XI0 AGND AVDD VINM VINP VOUT PD DALLASAMP_HT4 / VPD AVDD PD 0 / .ends DRV8301</Text> / <Dependency>0\dallasamp_ht4</Dependency> / </Model> / </CacheFrame> / </root>